# Altium project PCB_Project1.PrjPCB
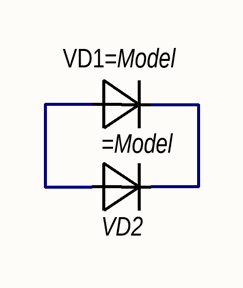
[diagram p0: Sheet1.SchDoc]
1 sheet, 2 parts. Net scope: global (net labels, ports and power ports of the same name join across sheets).
Board file: PCB1.PcbDoc

## Sheet Sheet1.SchDoc
size A4

### Parts
(Parts that share a designator on the sheet are numbered #1, #2 ... from top to bottom, then left to right.)
=Model#1  VD1  [DO-35 300mil]
=Model#2  VD2  [123]

### Nets
Net=Model#1_1: =Model#1.1(Anode) =Model#2.1(Anode)
Net=Model#1_2: =Model#1.2(Cathode) =Model#2.2(Cathode)

### Library data of the parts
=Model#1 =Model#2 = VD?: Model: 1N4148